# Altium project 4k-bias-board.PrjPcb
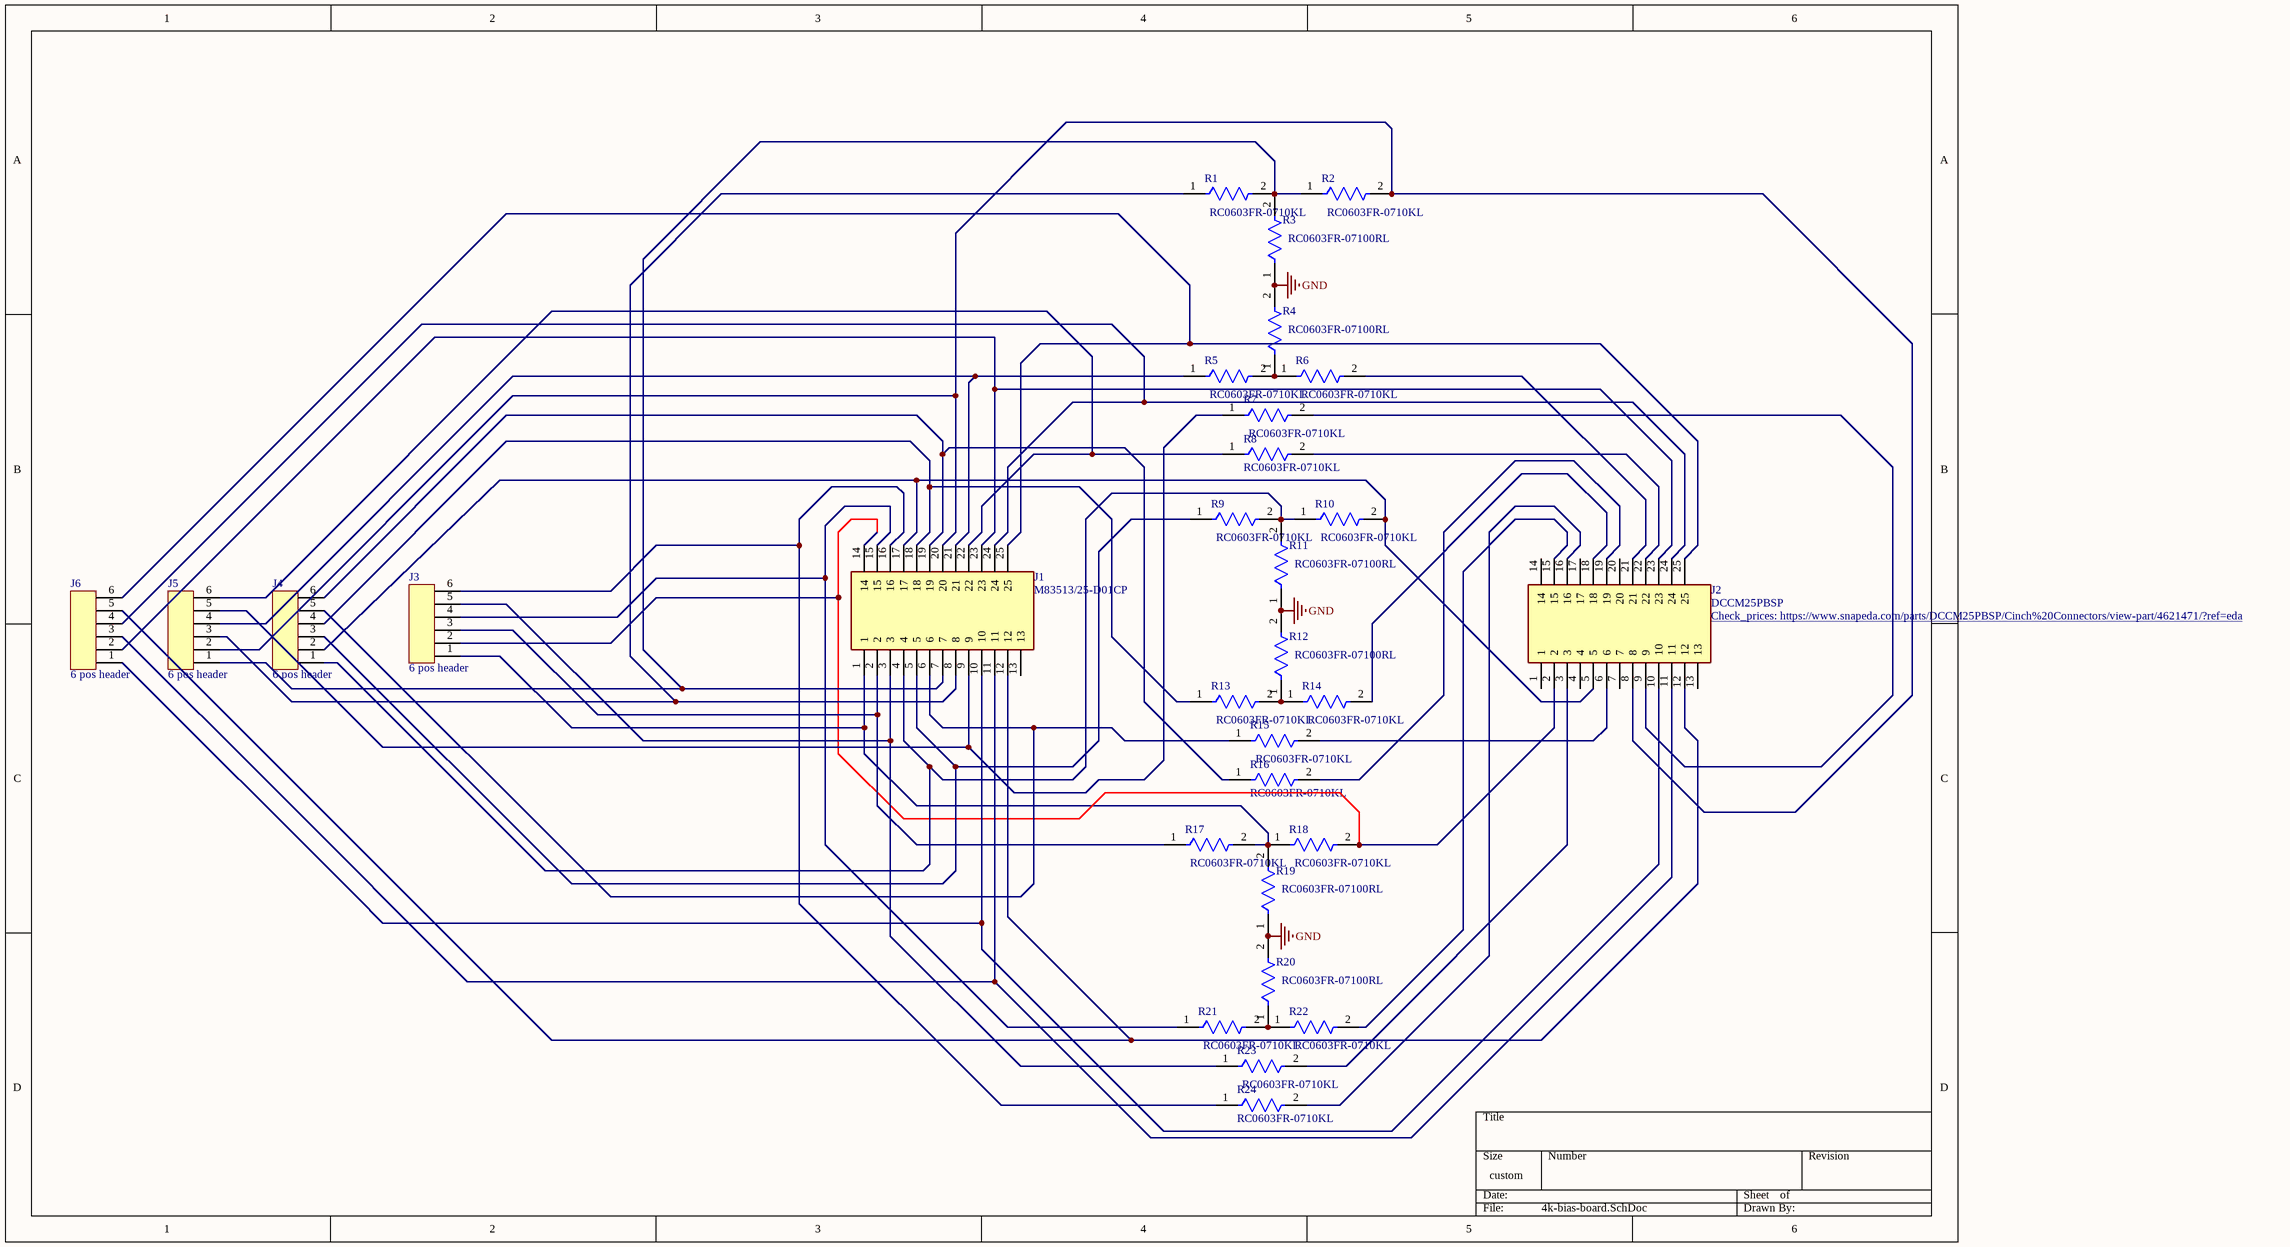
[diagram p0: 4k-bias-board.SchDoc]
1 sheet, 30 parts. Net scope: global (net labels, ports and power ports of the same name join across sheets).
Board file: 4k-bias-board.PcbDoc

## Sheet 4k-bias-board.SchDoc
size 381 x 241 mm; SheetNumber: 1; SheetTotal: 1

### Parts
J1  M83513/25-D01CP  [BEL_M83513/25-D01CP]
J2  DCCM25PBSP  [BEL_DCCM25PBSP]
J3  6 pos header  [6 pin header]
J4  6 pos header  [6 pin header]
J5  6 pos header  [6 pin header]
J6  6 pos header  [6 pin header]
R1  RC0603FR-0710KL  [FP-RC0603-0_55-IPC_C]
R2  RC0603FR-0710KL  [FP-RC0603-0_55-IPC_C]
R3  RC0603FR-07100RL  [FP-RC0603-0_55-MFG]
R4  RC0603FR-07100RL  [FP-RC0603-0_55-MFG]
R5  RC0603FR-0710KL  [FP-RC0603-0_55-IPC_C]
R6  RC0603FR-0710KL  [FP-RC0603-0_55-IPC_C]
R7  RC0603FR-0710KL  [FP-RC0603-0_55-IPC_C]
R8  RC0603FR-0710KL  [FP-RC0603-0_55-IPC_C]
R9  RC0603FR-0710KL  [FP-RC0603-0_55-IPC_C]
R10  RC0603FR-0710KL  [FP-RC0603-0_55-IPC_C]
R11  RC0603FR-07100RL  [FP-RC0603-0_55-MFG]
R12  RC0603FR-07100RL  [FP-RC0603-0_55-MFG]
R13  RC0603FR-0710KL  [FP-RC0603-0_55-IPC_C]
R14  RC0603FR-0710KL  [FP-RC0603-0_55-IPC_C]
R15  RC0603FR-0710KL  [FP-RC0603-0_55-IPC_C]
R16  RC0603FR-0710KL  [FP-RC0603-0_55-IPC_C]
R17  RC0603FR-0710KL  [FP-RC0603-0_55-IPC_C]
R18  RC0603FR-0710KL  [FP-RC0603-0_55-IPC_C]
R19  RC0603FR-07100RL  [FP-RC0603-0_55-MFG]
R20  RC0603FR-07100RL  [FP-RC0603-0_55-MFG]
R21  RC0603FR-0710KL  [FP-RC0603-0_55-IPC_C]
R22  RC0603FR-0710KL  [FP-RC0603-0_55-IPC_C]
R23  RC0603FR-0710KL  [FP-RC0603-0_55-IPC_C]
R24  RC0603FR-0710KL  [FP-RC0603-0_55-IPC_C]

### Nets
GND: R3.1 R4.2 R11.1 R12.2 R19.1 R20.2
NetJ1_1: J1.1 J3.1 R17.2 R18.1 R19.2
NetJ1_2: J1.2 J3.3 R17.1
NetJ1_3: J1.3 J3.5 R23.1
NetJ1_4: J1.4 J4.1 R9.2 R10.1 R11.2
NetJ1_5: J1.5 J4.3 R9.1
NetJ1_6: J1.6 J4.5 R15.1
NetJ1_7: J1.7 J5.1 R1.2 R2.1 R3.2
NetJ1_8: J1.8 J5.3 R1.1
NetJ1_9: J1.9 J5.5 R7.1
NetJ1_10: J1.10 J2.10 J6.1
NetJ1_11: J1.11 J2.11 J6.3
NetJ1_12: J1.12 J2.12 J6.5
NetJ1_14: J1.14 J2.2 J3.2 R18.2
NetJ1_15: J1.15 J3.4 R21.1
NetJ1_16: J1.16 J3.6 R24.1
NetJ1_17: J1.17 J2.5 J4.2 R10.2
NetJ1_18: J1.18 J4.4 R13.1
NetJ1_19: J1.19 J4.6 R16.1
NetJ1_20: J1.20 J2.8 J5.2 R2.2
NetJ1_21: J1.21 J5.4 R5.1
NetJ1_22: J1.22 J5.6 R8.1
NetJ1_23: J1.23 J2.23 J6.2
NetJ1_24: J1.24 J2.24 J6.4
NetJ1_25: J1.25 J2.25 J6.6
NetJ2_3: J2.3 R23.2
NetJ2_6: J2.6 R15.2
NetJ2_9: J2.9 R7.2
NetJ2_15: J2.15 R22.2
NetJ2_16: J2.16 R24.2
NetJ2_18: J2.18 R14.2
NetJ2_19: J2.19 R16.2
NetJ2_21: J2.21 R6.2
NetJ2_22: J2.22 R8.2
NetR4_1: R4.1 R5.2 R6.1
NetR12_1: R12.1 R13.2 R14.1
NetR20_1: R20.1 R21.2 R22.1

Not connected (* = marked no-connect by the designer): J1 13; J2 1 4 7 13 14 17 20

### Library data of the parts
J1 = M83513/25-D01CP: MIL-DTL-83513 PCB Mounted Connector | Socket | 25 Positions | Shell Finish - Cadmium | Female | PCB Solder Pins | 0.109" (2.77 mm) Pin Length; Package: None; Price: None; Value: *; MP: M83513/25-D01CP; Availability: Unavailable
J2 = DCCM25PBSP: Commercial PCB Mount Connector | Plug | 25 Positions | Yellow Chromate over Cadmium | Thermoset, Glass-Reinforced, Diallyl Phthalate | Male | Straight PCB | Standard Profile | Jackpost; MF: Cinch Connectivity Solutions; MP: DCCM25PBSP; Digi-Key_Part_Number: 116-1298-ND; Package: None; Value: *; Purchase-URL: https://pricing.snapeda.com/search/part/DCCM25PBSP/?ref=eda; SnapEDA_Link: https://www.snapeda.com/parts/DCCM25PBSP/Cinch%20Connectors/view-part/4621471/?ref=snap; Check_prices: https://www.snapeda.com/parts/DCCM25PBSP/Cinch%20Connectors/view-part/4621471/?ref=eda
J3-J6 = 6 pos header: CONN HEADER VERT 6POS 2.54MM - MTA100 Series; Manufacturer_Part_Number: 1755532; Built_By: EMA_Kyle; Vendor: Phoenix Contact; SourceLibrary: Phoenix_Contact_2018-12-18; Copyright: Copyright (C) 2018 Accelerated Designs. All rights reserved; RefDes: RefDes; Type: DEV; Supplier 1: Digi-Key; Supplier Part Number 1: A19433-ND
R1 R2 R5-R10 R13-R18 R21-R24 = CMP-2100-03664-2: RES 10K OHM 1% 1/10W 0603; Voltage Rating: 75V; Voltage Rating (DC): 50V; Resistance: 10kR; Power Rating: 100mW; Temperature Coefficient: 100ppm/°C; Depth: 0.8mm; Termination: SMD/SMT; Resistor Type: Thick Film; Series: RC; Construction: Rectangular; Features: Moisture Resistant; Packaging: Tape and Reel; Min Operating Temperature: -55°C; Number of Terminations: 2; Lead Pitch: 0.3mm; RoHS Compliant: Yes; Case/Package: 0603; Resistance Tolerance: 1%; Military Standard: Not; Weight: 7.1E-05oz; Number of Pins: 2; Tolerance: 1%; Length: 1.6mm; Case Code (Imperial): 0603; Lead Free: Lead Free; Width: 0.8mm; Max Power Dissipation: 100mW; Height: 0.45mm; Max Operating Temperature: 155°C; Case Code (Metric): 1608; Size Code: 0603
R3 R4 R11 R12 R19 R20 = CMP-2100-03663-2: NexarPartId: 55402879; Voltage Rating: 50V; Power Rating: 100mW; Tolerance: 1%; Temperature Coefficient: 100ppm/°C; Resistance: 100Ω; Case/Package: 0603; Military Standard: Not; REACH SVHC: Unknown; Case Code (Metric): 0603; Max Operating Temperature: 155°C; Schedule B: 8533210045, 8533210045; Height: 450µm; Length: 1.6mm; Lead Free: Lead Free; Packaging: Tape & Reel; Case Code (Imperial): 0603; Composition: Thick Film; Min Operating Temperature: -55°C; Voltage Rating (DC): 50V; RoHS: Compliant; Depth: 800µm; Number of Pins: 2; Termination: SMD/SMT; Width: 800µm